# EAGLE design esp8266mb (EAGLE 8.6.3)
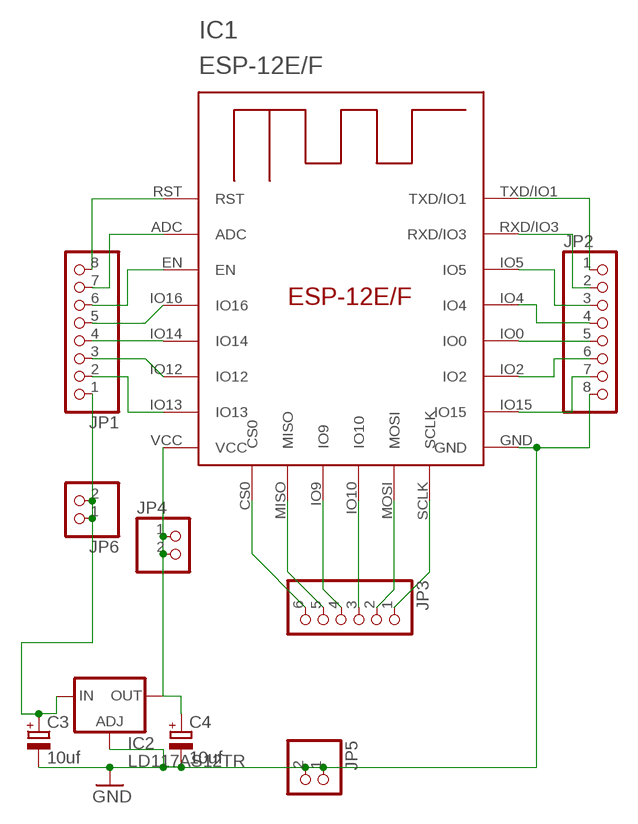
[diagram p0: schematic, sheet 1]

## Parts
C3  10uf  CPOL-EUE5-5  [E5-5]
C4  10uf  CPOL-EUE5-5  [E5-5]
IC1  ESP-12E/F  [ESP-12E]
IC2  LD117AS12TR  [SOT223]
JP1  PINHD-1X8  [1X08]
JP2  PINHD-1X8  [1X08]
JP3  PINHD-1X6  [1X06]
JP4  PINHD-1X2  [1X02]
JP5  PINHD-1X2  [1X02]
JP6  PINHD-1X2  [1X02]

## Nets
GND: C3.- C4.- IC1.GND IC2.1(ADJ) JP2.8 JP5.1 JP5.2
N$1: IC1.RST JP1.8
N$2: IC1.ADC JP1.7
N$3: IC1.EN JP1.6
N$4: IC1.IO16 JP1.5
N$5: IC1.IO14 JP1.4
N$6: IC1.IO12 JP1.3
N$7: IC1.IO13 JP1.2
N$8: C3.+ IC2.3(IN) JP1.1 JP6.1 JP6.2
N$10: IC1.TXD/IO1 JP2.1
N$11: IC1.RXD/IO3 JP2.2
N$12: IC1.IO5 JP2.3
N$13: IC1.IO15 JP2.7
N$14: IC1.IO2 JP2.6
N$15: IC1.IO0 JP2.5
N$16: IC1.IO4 JP2.4
N$17: IC1.CS0 JP3.6
N$18: IC1.SCLK JP3.1
N$19: IC1.MOSI JP3.2
N$20: IC1.MISO JP3.5
N$21: IC1.IO9 JP3.4
N$22: IC1.IO10 JP3.3
N$23: C4.+ IC1.VCC IC2.4(OUT) JP4.1 JP4.2

## Library data of the parts
C3 C4 = resistor:CPOL-EU: POLARIZED CAPACITOR, European symbol
IC1 = esp-12e-f:ESP-12E/F
IC2 = v-reg:LD117A?*: Low drop fixed and adjustable positive voltage regulators 1 A Source: http://www.st.com/stonline/products/literature/ds/7194/ld1117axx.pdf
JP1 JP2 = pinhead:PINHD-1X8: PIN HEADER
JP3 = pinhead:PINHD-1X6: PIN HEADER
JP4-JP6 = pinhead:PINHD-1X2: PIN HEADER

## Board
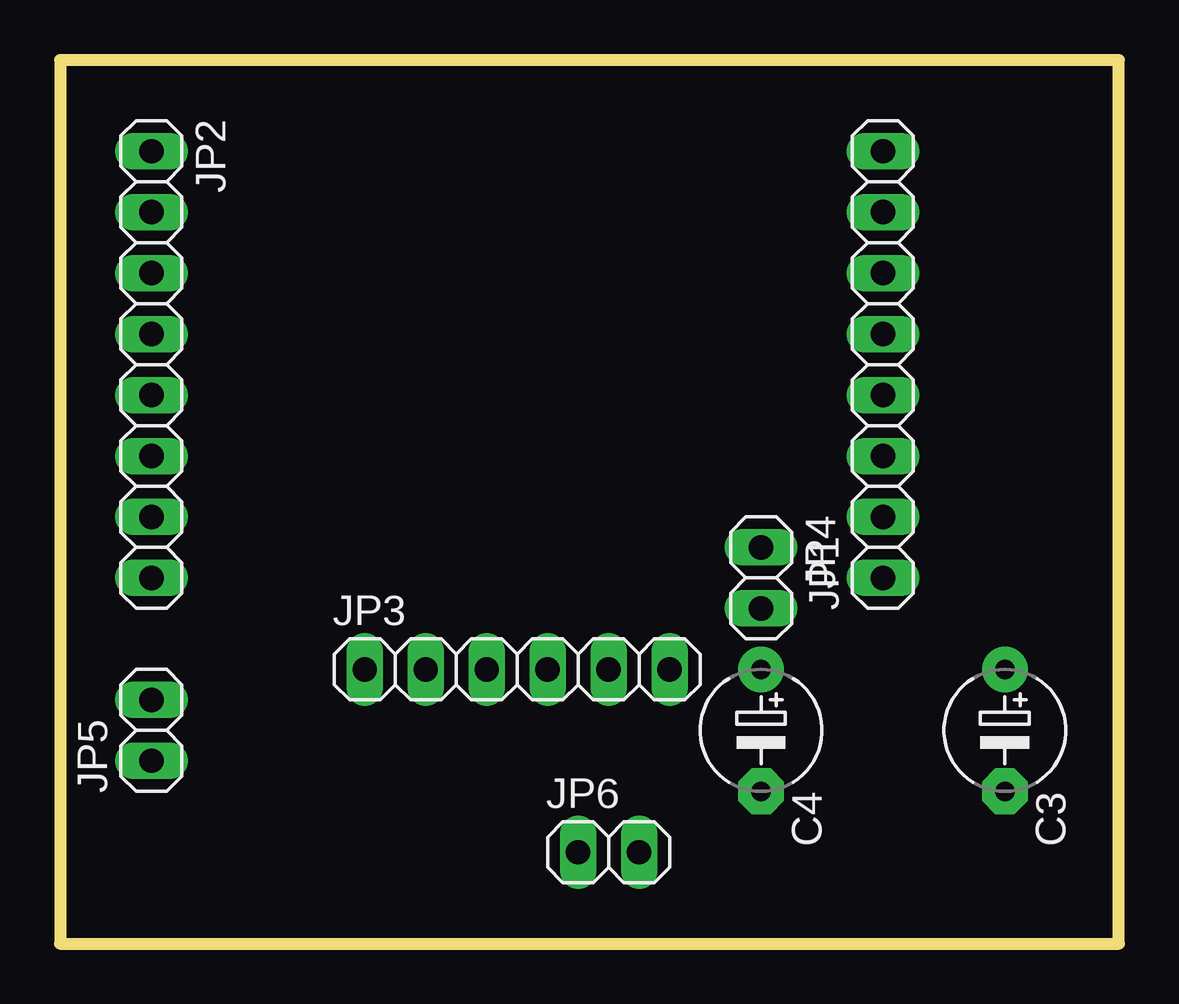
[diagram p1: board, top side]
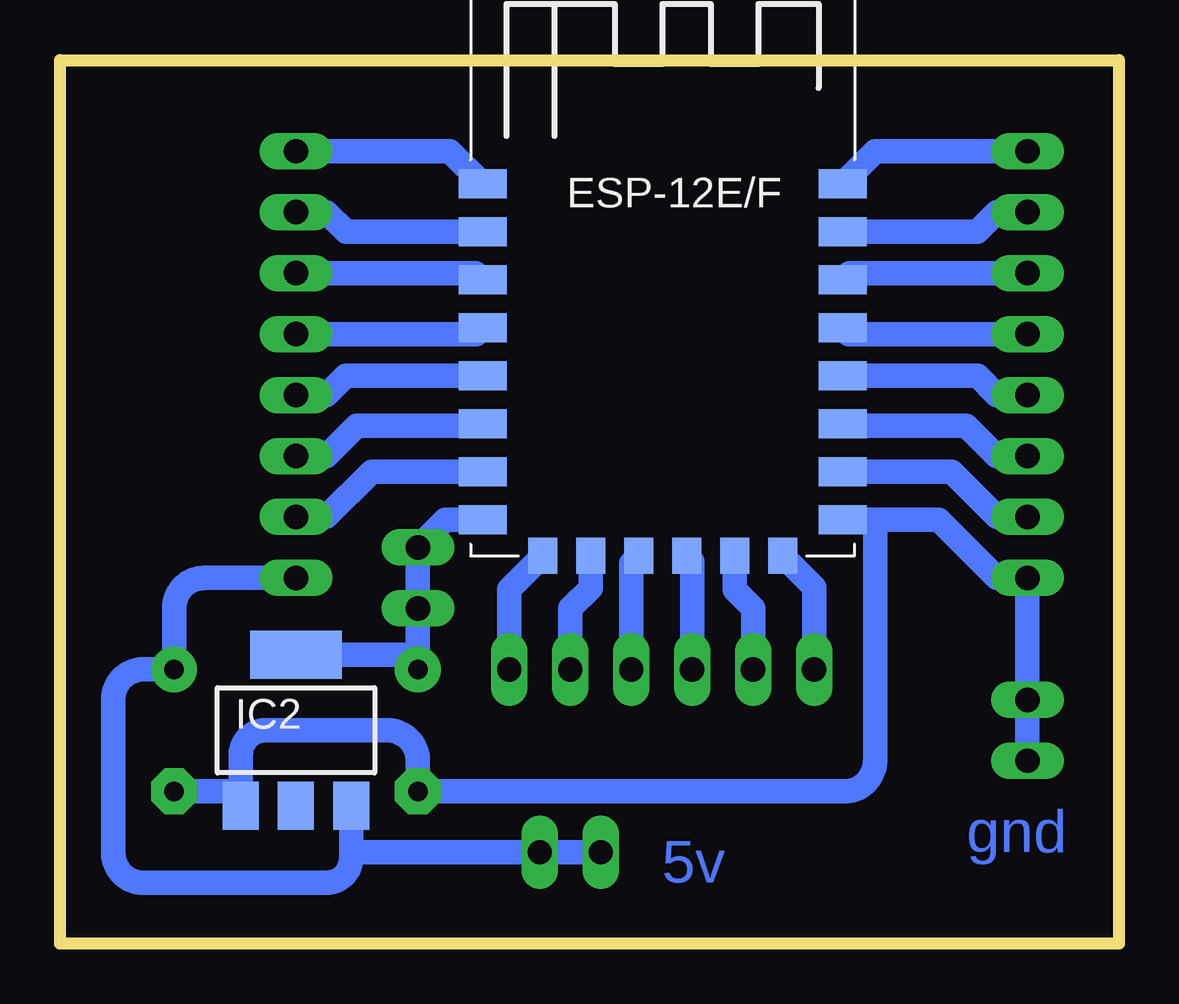
[diagram p2: board, bottom side, seen from below]

Size 44.12 x 36.82 mm. Coordinates in mm from the lower left corner, seen from the top.
Outline: 0,0 44.12,0 44.12,36.82 0,36.82 0,0
Copper layers (1*16): Top 0.035mm / dielectric 1.5mm / Bottom 0.035mm
Design rules "default": minimum track width 6mil, minimum drill 0.35mm, track to track 6mil, track to pad 6mil, pad to pad 6mil, via to via 6mil, smd to smd 6mil, copper to edge 40mil, drill to drill 6mil, minimum pad ring 10mil, minimum via ring 8mil, stop-mask expansion 4mil, vias tented up to drill 0mil, thermal gap 10mil

### Footprints (pad centres in the part's own frame; a part is rotated, then mirrored left to right if it is on the bottom)
E5-5 = drill 0.813 pad 1.905: + -2.54,0 | drill 0.813 pad 1.905 octagon: - 2.54,0
ESP-12E = smd 2 x 1.2: ADC -7.46,5.53; EN -7.46,3.53; GND 7.54,-6.47; IO0 7.54,-0.47; IO2 7.54,-2.47; IO4 7.54,1.53; IO5 7.54,3.53; IO12 -7.46,-2.47; IO13 -7.46,-4.47; IO14 -7.46,-0.47; IO15 7.54,-4.47; IO16 -7.46,1.53; RST -7.46,7.53; RXD/IO3 7.54,5.53; TXD/IO1 7.54,7.53; VCC -7.46,-6.47 | smd 1.2 x 1.5: CS0 -4.96,-7.97; IO9 -0.96,-7.97; IO10 1.04,-7.97; MISO -2.96,-7.97; MOSI 3.04,-7.97; SCLK 5.04,-7.97
SOT223 = smd 1.5 x 2: 1 -2.3,-3.15; 2 0,-3.15; 3 2.3,-3.15 | smd 3.8 x 2: 4 0,3.15
1X08 = drill 1.016 long: 1 -8.89,0; 2 -6.35,0; 3 -3.81,0; 4 -1.27,0; 5 1.27,0; 6 3.81,0; 7 6.35,0; 8 8.89,0
1X06 = drill 1.016 long: 1 -6.35,0; 2 -3.81,0; 3 -1.27,0; 4 1.27,0; 5 3.81,0; 6 6.35,0
1X02 = drill 1.016 long: 1 -1.27,0; 2 1.27,0

### Placement (x,y rotation side)
C3  39.37,8.89 270 top
C4  29.21,8.89 270 top
IC1  19.05,24.13 0 bottom
IC2  34.29,8.89 0 bottom
JP1  34.29,24.13 90 top
JP2  3.81,24.13 270 top
JP3  19.05,11.43 0 top
JP4  29.21,15.24 270 top
JP5  3.81,8.89 90 top
JP6  22.86,3.81 0 top

### Tracks (layer width: path | path; a pad name or v marks a point on that pad's centre or on a via)
GND
  Bottom 1.016: IC1.GND 10.16,17.66 | 10.16,17.66 7.5,17.66 5.08,15.24 JP2.8 JP5.2 JP5.1 | 10.16,17.66 10.16,7.62 arc90 11.43,6.35 C4.- 29.21,7.62 arc-90 30.48,8.89 35.56,8.89 arc-90 36.59,7.86 36.59,6.35 | IC2.1 36.59,6.35 | C3.- 36.59,6.35
N$1
  Bottom 1.016: IC1.RST 27.87,33.02 JP1.8
N$2
  Bottom 1.016: IC1.ADC 32.2,29.66 33.02,30.48 JP1.7
N$3
  Bottom 1.016: IC1.EN 26.79,27.94 JP1.6
N$4
  Bottom 1.016: IC1.IO16 26.77,25.4 JP1.5
N$5
  Bottom 1.016: IC1.IO14 32.22,23.66 33.02,22.86 JP1.4
N$6
  Bottom 1.016: IC1.IO12 26.58,21.59 31.75,21.59 33.02,20.32 JP1.3
N$7
  Bottom 1.016: IC1.IO13 31.14,19.66 33.02,17.78 JP1.2
N$8
  Bottom 1.016: 31.99,4.84 IC2.3 31.99,3.57 | 31.99,3.57 arc90 33.02,2.54 40.64,2.54 arc90 41.91,3.81 41.91,10.16 arc90 40.64,11.43 C3.+ 39.37,13.97 arc90 38.1,15.24 JP1.1 | JP6.1 JP6.2 31.75,3.81 arc-90 31.99,3.57
N$10
  Bottom 1.016: IC1.TXD/IO1 10.15,33.02 JP2.1
N$11
  Bottom 1.016: IC1.RXD/IO3 5.9,29.66 5.08,30.48 JP2.2
N$12
  Bottom 1.016: IC1.IO5 11.23,27.94 JP2.3
N$13
  Bottom 1.016: IC1.IO15 6.96,19.66 5.08,17.78 JP2.7
N$14
  Bottom 1.016: IC1.IO2 11.44,21.59 6.35,21.59 5.08,20.32 JP2.6
N$15
  Bottom 1.016: IC1.IO0 5.88,23.66 5.08,22.86 JP2.5
N$16
  Bottom 1.016: IC1.IO4 11.25,25.4 JP2.4
N$17
  Bottom 1.016: IC1.CS0 25.4,14.77 JP3.6
N$18
  Bottom 1.016: IC1.SCLK 12.7,14.85 JP3.1
N$19
  Bottom 1.016: IC1.MOSI 16.01,14.74 15.24,13.97 JP3.2
N$20
  Bottom 1.016: IC1.MISO 22.01,14.82 22.86,13.97 JP3.5
N$21
  Bottom 1.016: IC1.IO9 20.32,15.85 JP3.4
N$22
  Bottom 1.016: IC1.IO10 17.78,15.93 JP3.3
N$23
  Bottom 1.016: IC1.VCC 28.06,17.66 JP4.1 JP4.2 C4.+ 29.82,12.04 IC2.4

### Text on the board
Bottom: gnd | 5v